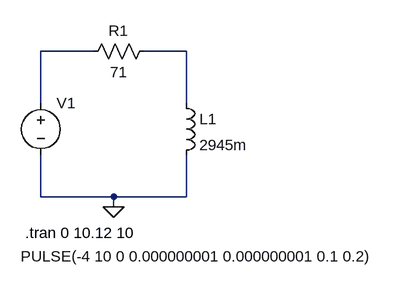
[diagram p0: schematic RL.asc]
RL.asc, the LTspice schematic file:
Version 4
SHEET 1 880 680
WIRE -32 -112 -112 -112
WIRE 112 -112 48 -112
WIRE -112 -32 -112 -112
WIRE 112 -32 112 -112
WIRE -112 112 -112 48
WIRE 0 112 -112 112
WIRE 112 112 112 48
WIRE 112 112 0 112
WIRE 0 128 0 112
FLAG 0 128 0
SYMBOL voltage -112 -48 R0
WINDOW 123 0 0 Left 0
WINDOW 39 0 0 Left 0
WINDOW 3 -31 252 Left 2
SYMATTR Value PULSE(-4 10 0 0.000000001 0.000000001 0.1 0.2)
SYMATTR InstName V1
SYMBOL res 64 -128 R90
WINDOW 0 0 56 VBottom 2
WINDOW 3 32 56 VTop 2
SYMATTR InstName R1
SYMATTR Value 71
SYMBOL ind 96 -48 R0
SYMATTR InstName L1
SYMATTR Value 2945m
SYMATTR SpiceLine Rser=24
TEXT -136 168 Left 2 !.tran 0 10.12 10

The netlist it stands for:
* RL.asc
V1 N001 0 PULSE(-4 10 0 0.000000001 0.000000001 0.1 0.2)
R1 N002 N001 71
L1 N002 0 2945m Rser=24
.tran 0 10.12 10
.backanno
.end